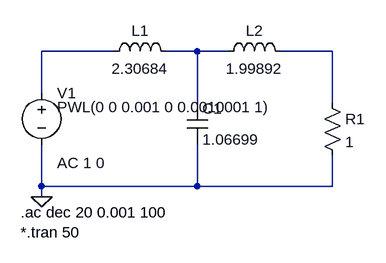
[diagram p0: schematic 2_chev_stdlpf.asc]
2_chev_stdlpf.asc, the LTspice schematic file:
Version 4
SHEET 1 880 680
WIRE 128 80 16 80
WIRE 256 80 208 80
WIRE 304 80 256 80
WIRE 464 80 384 80
WIRE 16 144 16 80
WIRE 256 160 256 80
WIRE 464 160 464 80
WIRE 16 288 16 224
WIRE 256 288 256 224
WIRE 256 288 16 288
WIRE 464 288 464 240
WIRE 464 288 256 288
WIRE 16 304 16 288
FLAG 16 304 0
SYMBOL voltage 16 128 R0
WINDOW 123 24 124 Left 2
WINDOW 39 0 0 Left 2
WINDOW 3 24 38 Left 2
SYMATTR Value2 AC 1 0
SYMATTR Value PWL(0 0 0.001 0 0.0010001 1)
SYMATTR InstName V1
SYMBOL cap 240 160 R0
SYMATTR InstName C1
SYMATTR Value 1.06699
SYMBOL ind 112 96 R270
WINDOW 0 32 56 VTop 2
WINDOW 3 5 56 VBottom 2
SYMATTR InstName L1
SYMATTR Value 2.30684
SYMBOL ind 288 96 R270
WINDOW 0 32 56 VTop 2
WINDOW 3 5 56 VBottom 2
SYMATTR InstName L2
SYMATTR Value 1.99892
SYMBOL res 448 144 R0
SYMATTR InstName R1
SYMATTR Value 1
TEXT -16 328 Left 2 !.ac dec 20 0.001 100\n*.tran 50

The netlist it stands for:
* 2_chev_stdlpf.asc
V1 N001 0 PWL(0 0 0.001 0 0.0010001 1) AC 1 0
C1 N002 0 1.06699
L1 N001 N002 2.30684
L2 N002 N003 1.99892
R1 N003 0 1
.ac dec 20 0.001 100
*.tran 50
.backanno
.end